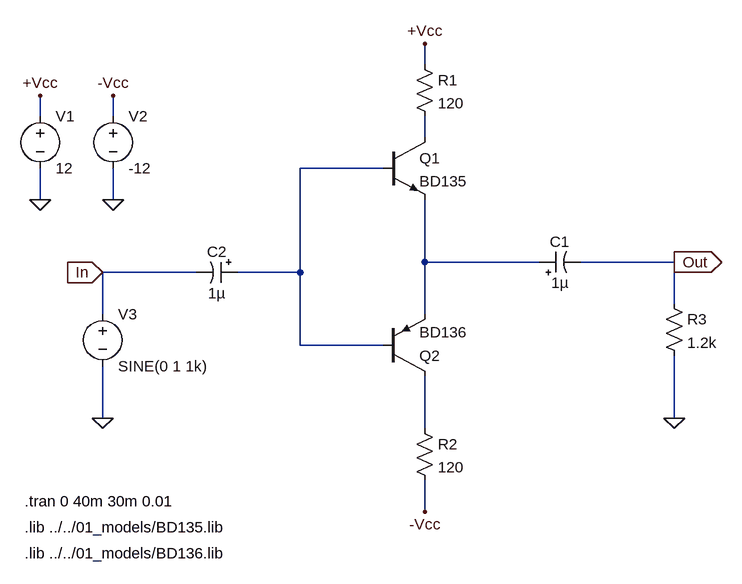
[diagram p0: schematic powamp_06_02_02_class_b.asc]
powamp_06_02_02_class_b.asc, the LTspice schematic file:
Version 4
SHEET 1 880 872
WIRE -176 -1040 -176 -1072
WIRE -768 -960 -768 -992
WIRE -656 -960 -656 -992
WIRE -176 -928 -176 -960
WIRE -240 -880 -368 -880
WIRE -768 -832 -768 -880
WIRE -656 -832 -656 -880
WIRE -176 -736 -176 -832
WIRE 0 -736 -176 -736
WIRE 208 -736 64 -736
WIRE -528 -720 -672 -720
WIRE -368 -720 -368 -880
WIRE -368 -720 -464 -720
WIRE 208 -672 208 -736
WIRE -672 -656 -672 -720
WIRE -176 -656 -176 -736
WIRE -368 -608 -368 -720
WIRE -240 -608 -368 -608
WIRE -672 -496 -672 -576
WIRE 208 -496 208 -592
WIRE -176 -480 -176 -560
WIRE -176 -352 -176 -400
FLAG -768 -832 0
FLAG -656 -832 0
FLAG -768 -992 +Vcc
FLAG -656 -992 -Vcc
FLAG -176 -352 -Vcc
FLAG -176 -1072 +Vcc
FLAG -672 -496 0
FLAG 208 -736 Out
IOPIN 208 -736 Out
FLAG -672 -720 In
IOPIN -672 -720 In
FLAG 208 -496 0
SYMBOL res -192 -1056 R0
SYMATTR InstName R1
SYMATTR Value 120
SYMBOL res -192 -496 R0
SYMATTR InstName R2
SYMATTR Value 120
SYMBOL res 192 -688 R0
SYMATTR InstName R3
SYMATTR Value 1.2k
SYMBOL polcap 0 -720 R270
WINDOW 0 32 32 VTop 2
WINDOW 3 0 32 VBottom 2
SYMATTR InstName C1
SYMATTR Value 1µ
SYMBOL polcap -464 -736 R90
WINDOW 0 0 32 VBottom 2
WINDOW 3 32 32 VTop 2
SYMATTR InstName C2
SYMATTR Value 1µ
SYMBOL voltage -768 -976 R0
WINDOW 123 0 0 Left 2
WINDOW 39 0 0 Left 2
SYMATTR InstName V1
SYMATTR Value 12
SYMBOL voltage -656 -976 R0
WINDOW 123 0 0 Left 2
WINDOW 39 0 0 Left 2
SYMATTR InstName V2
SYMATTR Value -12
SYMBOL voltage -672 -672 R0
WINDOW 123 0 0 Left 2
WINDOW 39 0 0 Left 2
SYMATTR InstName V3
SYMATTR Value SINE(0 1 1k)
SYMBOL npn2 -240 -928 R0
SYMATTR InstName Q1
SYMATTR Value BD135
SYMBOL pnp2 -240 -560 M180
SYMATTR InstName Q2
SYMATTR Value BD136
TEXT -792 -368 Left 2 !.tran 0 40m 30m 0.01
TEXT -792 -328 Left 2 !.lib ../../01_models/BD135.lib
TEXT -792 -288 Left 2 !.lib ../../01_models/BD136.lib

The netlist it stands for:
* powamp_06_02_02_class_b.asc
R1 +Vcc N001 120
R2 N004 -Vcc 120
R3 Out 0 1.2k
C1 N003 Out 1µ
C2 N002 In 1µ
V1 +Vcc 0 12
V2 -Vcc 0 -12
V3 In 0 SINE(0 1 1k)
Q1 N001 N002 N003 0 BD135
Q2 N004 N002 N003 0 BD136
.model NPN NPN
.model PNP PNP
.lib standard.bjt
.tran 0 40m 30m 0.01
.lib ../../01_models/BD135.lib
.lib ../../01_models/BD136.lib
.backanno
.end